# EAGLE design tinyPipes v2.6 (EAGLE 6.5.0)

## Sheet 1 of 3
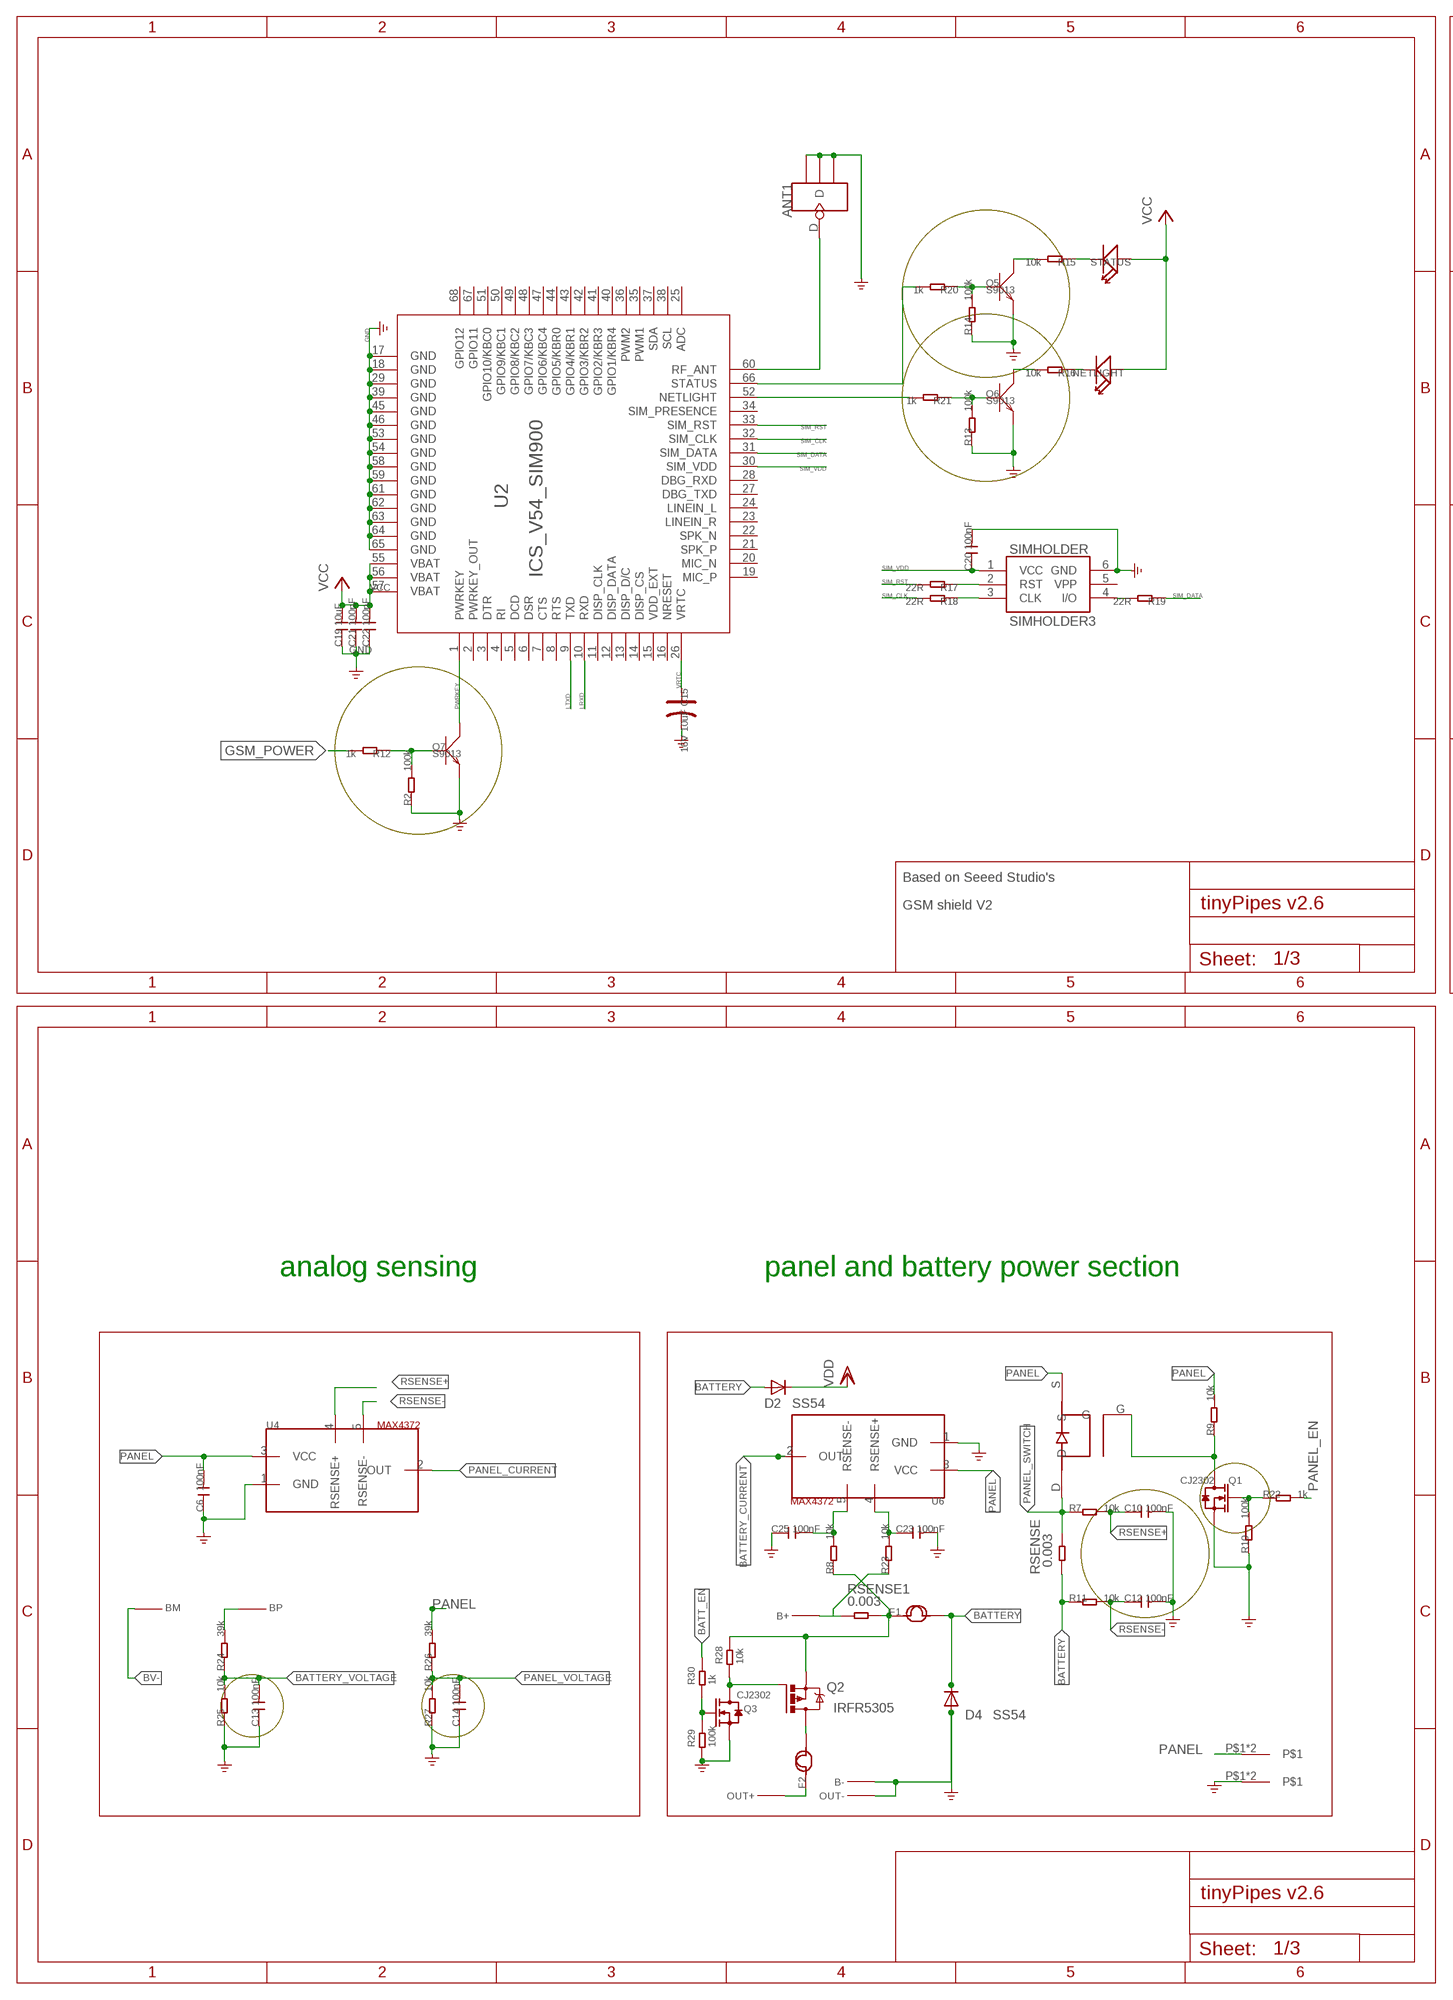
[diagram p0: schematic, sheet 1, part 1 of 2]
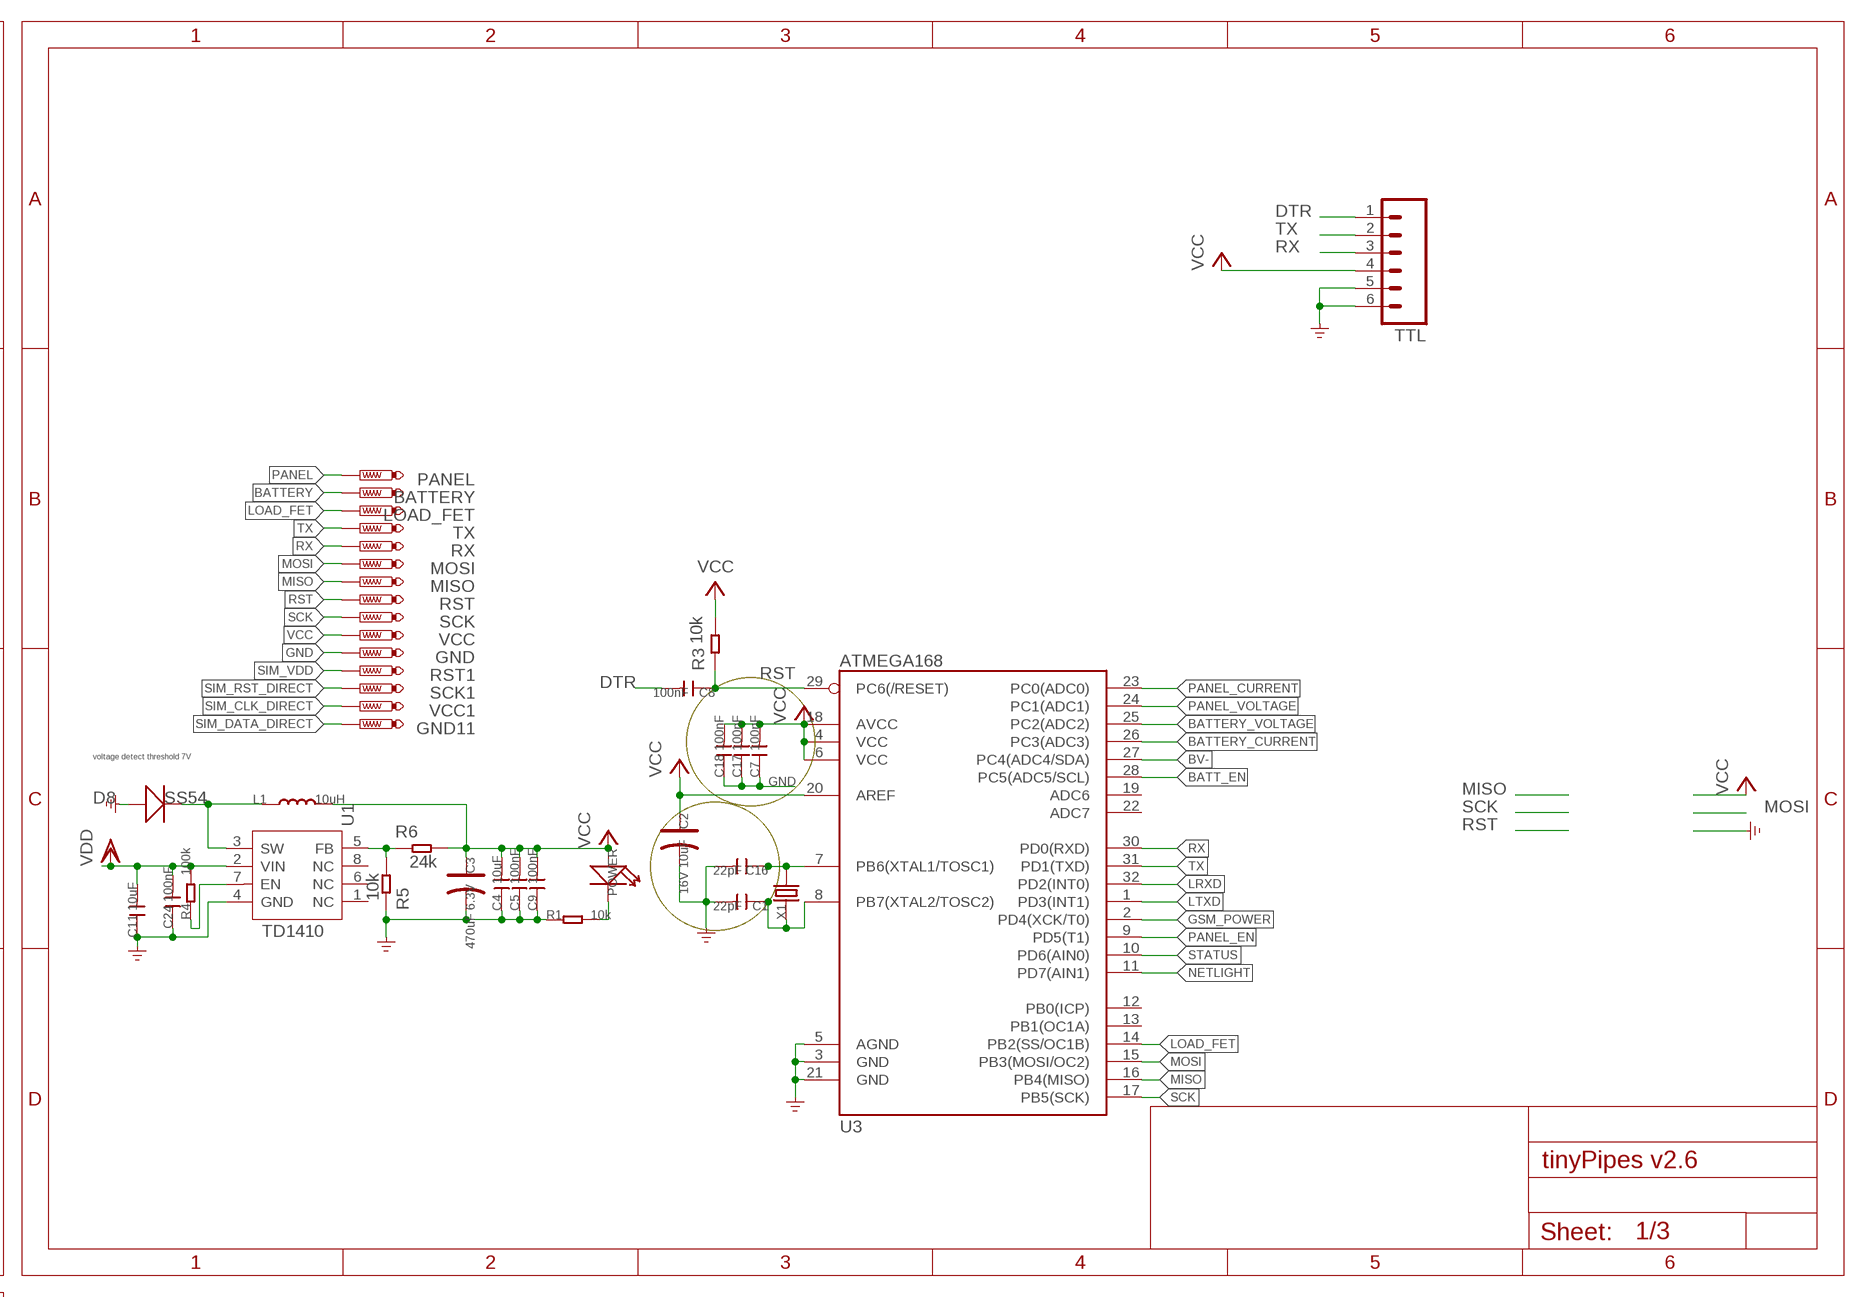
[diagram p1: schematic, sheet 1, part 2 of 2]

### Parts
ANT1  ANTENNA-U-FL  [4P-U-FL]
B+  TINYPIPES_BATTBATT  [TINYPIPES_BATT]
B-  TINYPIPES_BATTBATT  [TINYPIPES_BATT]
BATTERY  PTR1B2,54  [B2,54]
BM  TINYPIPES_BATTSBATT  [TINYPIPES_SBATT]
BP  TINYPIPES_BATTSBATT  [TINYPIPES_SBATT]
C1  22pF  C-0603  [C0603]
C2  16V 10uF  CAP-AVX-A  [AVX-A]
C3  470uF 6.3V  CAP-AVX-D  [AVX-D]
C4  10uF  C-0805  [C0805]
C5  100nF  C-0603  [C0603]
C6  100nF  C-0603  [C0603]
C7  100nF  C-0603  [C0603]
C8  100nF  C-0603  [C0603]
C9  100nF  C-0603  [C0603]
C10  100nF  C-0805  [C0805]
C11  10uF  C-0805  [C0805]
C12  100nF  C-0805  [C0805]
C13  100nF  C-0603  [C0603]
C14  100nF  C-0603  [C0603]
C15  16V 10uF  CAP-AVX-A  [AVX-A]
C16  22pF  C-0603  [C0603]
C17  100nF  C-0603  [C0603]
C18  100nF  C-0603  [C0603]
C19  10uF  C-0805  [C0805]
C20  100nF  C-0603  [C0603]
C21  100nF  C-0603  [C0603]
C22  100nF  C-0603  [C0603]
C23  100nF  C-0805  [C0805]
C24  100nF  C-0603  [C0603]
C25  100nF  C-0805  [C0805]
D2  SS54  DIODE-SMB  [SMB]
D4  SS54  DIODE-SMB  [SMB]
D8  SS54  D'MBRS240LT3'  [SMB]
F1  FUSE16R700  [0210]
F2  FUSE16R700  [0210]
GND  PTR1B2,54  [B2,54]
GND11  PTR1B2,54  [B2,54]
L1  10uH  L'0630'  [L0630]
LOAD_FET  PTR1B2,54  [B2,54]
MISO  PTR1B2,54  [B2,54]
MOSI  PTR1B2,54  [B2,54]
NETLIGHT  LED'0603'  [LED-0603]
OUT+  TINYPIPES_BATTBATT  [TINYPIPES_BATT]
OUT-  TINYPIPES_BATTBATT  [TINYPIPES_BATT]
PANEL  PTR1B2,54  [B2,54]
PANEL+  TINYPIPES_BATTPANEL  [TINYPIPES_PANEL]
PANEL-  TINYPIPES_BATTPANEL  [TINYPIPES_PANEL]
POWER  LED'0603'  [LED-0603]
Q1  CJ2302  MOSFET-N'SOT23'  [SOT23]
Q2  IRFR5305  [D-PAK_TO252AA]
Q3  CJ2302  MOSFET-N'SOT23'  [SOT23]
Q5  S9013  TRANSISTOR-NPN-SOT23  [SOT23]
Q6  S9013  TRANSISTOR-NPN-SOT23  [SOT23]
Q7  S9013  TRANSISTOR-NPN-SOT23  [SOT23]
R1  10k  R-0603  [R0603]
R2  100k  R-0603  [R0603]
R3  10k  R-0603  [R0603]
R4  100k  R-0603  [R0603]
R5  10k  R-0603  [R0603]
R6  24k  R-0603  [R0603]
R7  10k  R-0603  [R0603]
R8  10k  R-0603  [R0603]
R9  10k  R-0603  [R0603]
R10  100k  R-0603  [R0603]
R11  10k  R-0603  [R0603]
R12  1k  R-0603  [R0603]
R13  100k  R-0603  [R0603]
R14  100k  R-0603  [R0603]
R15  10k  R-0603  [R0603]
R16  10k  R-0603  [R0603]
R17  22R  R-0603  [R0603]
R18  22R  R-0603  [R0603]
R19  22R  R-0603  [R0603]
R20  1k  R-0603  [R0603]
R21  1k  R-0603  [R0603]
R22  1k  R-0603  [R0603]
R23  10k  R-0603  [R0603]
R24  39k  R-0603  [R0603]
R25  10k  R-0603  [R0603]
R26  39k  R-0603  [R0603]
R27  10k  R-0603  [R0603]
R28  10k  R-0603  [R0603]
R29  100k  R-0603  [R0603]
R30  1k  R-0603  [R0603]
RSENSE  0.003  R-2512  [R2512]
RSENSE1  0.003  R-2512  [R2512]
RST  PTR1B2,54  [B2,54]
RST1  PTR1B2,54  [B2,54]
RX  PTR1B2,54  [B2,54]
SCK  PTR1B2,54  [B2,54]
SCK1  PTR1B2,54  [B2,54]
SIMHOLDER  SIMHOLDER3  [SIMHOLDER3]
STATUS  LED'0603'  [LED-0603]
TTL  M06LOCK  [1X06_LOCK]
TX  PTR1B2,54  [B2,54]
U1  TD1410  [SOP8]
U2  ICS_V54_SIM900  [ICS_V54_SIM900]
U3  ATMEGA168  [TQFP32-08]
U4  MAX4372  [SOT23-5]
U5  SI4435POWER  [SO8_FET]
U6  MAX4372  [SOT23-5]
VCC  PTR1B2,54  [B2,54]
VCC1  PTR1B2,54  [B2,54]
X1  CRYSTAL'5032'  [2P-SMD-5X3.2]

### Nets
BATT [power]: B+.1 R23.1 RSENSE1.1
BATT_EN: R30.2 U3.28(PC5(ADC5/SCL))
BATTERY [power]: BATTERY.TP D2.A D4.C F1.2 R11.1 RSENSE.1
BATTERY_CURRENT: U3.26(PC3(ADC3)) U6.2(OUT)
BATTERY_VOLTAGE: C13.2 R24.1 R25.2 U3.25(PC2(ADC2))
BV+: BP.P$1 R24.2
BV-: BM.P$1 U3.27(PC4(ADC4/SDA))
DTR: C8.2 TTL.1
GND: ANT1.GND1 ANT1.GND2 ANT1.GND3 B-.1 C1.2 C2.- C3.- C4.1 C5.1 C6.1 C7.1 C9.1 C10.2 C11.1 C12.2 C13.1 C14.1 C15.- C16.2 C17.1 C18.1 C19.1 C20.2 C21.1 C22.1 C23.2 C24.1 C25.1 D4.A D8.+ GND.TP OUT-.1 PANEL-.P$1 PANEL-.P$2 Q1.2(S) Q3.2(S) Q5.2(E) Q6.2(E) Q7.2(E) R1.1 R2.1 R5.2 R10.1 R13.1 R14.1 R25.1 R27.1 R29.1 SIMHOLDER.6(GND) TTL.5 TTL.6 U1.4(GND) U2.17(GND) U2.18(GND) U2.29(GND) U2.39(GND) U2.45(GND) U2.46(GND) U2.53(GND) U2.54(GND) U2.58(GND) U2.59(GND) U2.61(GND) U2.62(GND) U2.63(GND) U2.64(GND) U2.65(GND) U3.3(GND) U3.5(AGND) U3.21(GND) U4.1(GND) U6.1(GND)
GSM_POWER: R12.2 U3.2(PD4(XCK/T0))
LOAD_FET: LOAD_FET.TP U3.14(PB2(SS/OC1B))
LRXD: U2.10(RXD) U3.32(PD2(INT0))
LTXD: U2.9(TXD) U3.1(PD3(INT1))
MISO: MISO.TP U3.16(PB4(MISO))
MOSI: MOSI.TP U3.15(PB3(MOSI/OC2))
N$1: ANT1.D U2.60(RF_ANT)
N$2: C16.1 U3.7(PB6(XTAL1/TOSC1)) X1.2
N$3: Q6.3(C) R16.2
N$4: Q7.1(B) R2.2 R12.1
N$5: Q5.1(B) R14.2 R20.1
N$6: Q6.1(B) R13.2 R21.1
N$7: NETLIGHT.- R16.1
N$8: Q5.3(C) R15.2
N$9: POWER.- R1.2
N$10 [power]: F1.1 Q2.3(S) R8.1 R28.2 RSENSE1.2
N$11: Q1.1(G) R10.2 R22.1
N$12: R4.1 U1.7(EN)
N$13: C1.1 U3.8(PB7(XTAL2/TOSC2)) X1.1
N$14: C25.2 R8.2 U6.5(RSENSE-)
N$15: Q1.3(D) R9.1 U5.G
N$16: R15.1 STATUS.-
N$17: C23.1 R23.2 U6.4(RSENSE+)
N$18: F2.2 Q2.4(D)
N$19: F2.1 OUT+.1
N$20: Q2.1(G) Q3.3(D) R28.1
N$21: Q3.1(G) R29.2 R30.1
N$38: D8.- L1.1 U1.3(SW)
N$47: R5.1 R6.1 U1.5(FB)
NETLIGHT: R21.2 U2.52(NETLIGHT) U3.11(PD7(AIN1))
PANEL [power]: C6.2 PANEL+.P$1 PANEL+.P$2 PANEL.TP R9.2 R26.2 U4.3(VCC) U5.S U6.3(VCC)
PANEL_CURRENT: U3.23(PC0(ADC0)) U4.2(OUT)
PANEL_EN: R22.2 U3.9(PD5(T1))
PANEL_SWITCH [power]: R7.1 RSENSE.2 U5.D
PANEL_VOLTAGE: C14.2 R26.1 R27.2 U3.24(PC1(ADC1))
PWRKEY: Q7.3(C) U2.1(PWRKEY)
RSENSE+ [power]: C10.1 R7.2 U4.4(RSENSE+)
RSENSE- [power]: C12.1 R11.2 U4.5(RSENSE-)
RST: C8.1 R3.1 RST.TP U3.29(PC6(/RESET))
RX: RX.TP TTL.3 U3.30(PD0(RXD))
SCK: SCK.TP U3.17(PB5(SCK))
SIM_CLK: R18.2 U2.32(SIM_CLK)
SIM_CLK_DIRECT: R18.1 SIMHOLDER.3(CLK) VCC1.TP
SIM_DATA: R19.1 U2.31(SIM_DATA)
SIM_DATA_DIRECT: GND11.TP R19.2 SIMHOLDER.4(I/O)
SIM_RST: R17.2 U2.33(SIM_RST)
SIM_RST_DIRECT: R17.1 SCK1.TP SIMHOLDER.2(RST)
SIM_VDD: C20.1 RST1.TP SIMHOLDER.1(VCC) U2.30(SIM_VDD)
STATUS: R20.2 U2.66(STATUS) U3.10(PD6(AIN0))
TX: TTL.2 TX.TP U3.31(PD1(TXD))
VCC: C2.+ C3.+ C4.2 C5.2 C7.2 C9.2 C17.2 C18.2 C19.2 C21.2 C22.2 L1.2 NETLIGHT.+ POWER.+ R3.2 R6.2 STATUS.+ TTL.4 U2.55(VBAT) U2.56(VBAT) U2.57(VBAT) U3.4(VCC) U3.6(VCC) U3.18(AVCC) U3.20(AREF) VCC.TP
VDD: C11.2 C24.2 D2.C R4.2 U1.2(VIN)
VRTC: C15.+ U2.26(VRTC)
Unconnected: SIMHOLDER.5(VPP) U1.1(NC) U1.6(NC) U1.8(NC) U2.2(PWRKEY_OUT) U2.3(DTR) U2.4(RI) U2.5(DCD) U2.6(DSR) U2.7(CTS) U2.8(RTS) U2.11(DISP_CLK) U2.12(DISP_DATA) U2.13(DISP_D/C) U2.14(DISP_CS) U2.15(VDD_EXT) U2.16(NRESET) U2.19(MIC_P) U2.20(MIC_N) U2.21(SPK_P) U2.22(SPK_N) U2.23(LINEIN_R) U2.24(LINEIN_L) U2.25(ADC) U2.27(DBG_TXD) U2.28(DBG_RXD) U2.34(SIM_PRESENCE) U2.35(PWM1) U2.36(PWM2) U2.37(SDA) U2.38(SCL) U2.40(GPIO1/KBR4) U2.41(GPIO2/KBR3) U2.42(GPIO3/KBR2) U2.43(GPIO4/KBR1) U2.44(GPIO5/KBR0) U2.47(GPIO6/KBC4) U2.48(GPIO7/KBC3) U2.49(GPIO8/KBC2) U2.50(GPIO9/KBC1) U2.51(GPIO10/KBC0) U2.67(GPIO11) U2.68(GPIO12) U3.12(PB0(ICP)) U3.13(PB1(OC1A)) U3.19(ADC6) U3.22(ADC7)

### Notes on the sheet
- voltage detect threshold 7V
- Based on Seeed Studio's
- GSM shield V2
- analog sensing | panel and battery power section

## Sheet 2 of 3

## Sheet 3 of 3

## Library data of the parts
ANT1 = Connector:ANTENNA-U-FL
B+ B- BM BP OUT+ OUT- = tinyPipes v2.6:TINYPIPES_BATT
BATTERY GND GND11 LOAD_FET MISO MOSI PANEL RST RST1 RX SCK SCK1 TX VCC VCC1 = testpad:PTR1: TEST PIN
C1 C4-C14 C16-C25 = Discrete:C*: Ceramic Capacitors
C2 C3 C15 = Discrete:CAP*: Electrolytic Capacitors,Tantalum Capacitors and Super Capacitors
D2 D4 = diode:DIODE-: DIODE
D8 = Discrete:D*
F1 F2 = tinyPipes v2.6:FUSE
L1 = Discrete:L*
NETLIGHT POWER STATUS = Discrete:LED*
PANEL+ PANEL- = tinyPipes_v2.5:TINYPIPES_BATT
Q1 Q3 = Discrete:MOSFET-N: IRLL014: http://www.vishay.com/docs/91319/sihll014.pdf
Q2 = transistor-power:IRF?5305: HEXFET Power MOSFET Source: http://www.irf.com/product-info/datasheets/data/irfr5305pbf.pdf
Q5-Q7 = Discrete:TRANSISTOR-NPN*: NPN audion
R1-R30 RSENSE RSENSE1 = Discrete:R*
SIMHOLDER = SparkFun2:SIMHOLDER3
TTL = SparkFun-Connectors:M06: Header 6 Standard 6-pin 0.1" header. Use with straight break away headers (SKU : PRT-00116), right angle break away headers (PRT-00553), swiss pins (PRT-00743), machine pins (PRT-00117), and female headers (PRT-00115). Molex polarized connector foot print use with SKU : PRT-08094 with associated crimp pins and housings. NOTES ON THE VARIANTS LOCK and LOCK_LONGPADS... This footprint was designed to help hold the alignment of a through-hole component (i.e. 6-pin header) while soldering it into place. You may notice that each hole has been shifted either up or down by 0.005 of an inch from it's more standard position (which is a perfectly straight line). This slight alteration caused the pins (the squares in the middle) to touch the edges of the holes. Because they are alternating, it causes a "brace" to hold the component in place. 0.005 has proven to be the perfect amount of "off-center" position when using our standard breakaway headers. Although looks a little odd when you look at the bare footprint, once you have a header in there, the alteration is very hard to notice. Also,if you push a header all the way into place, it is covered up entirely on the bottom side. This idea of altering the position of holes to aid alignment will be further integrated into the Sparkfun Library for other footprints. It can help hold any component with 3 or more connection pins.
U1 = template:TD1410: 2A 380KHz 20V PWM Buck DC/DC Converter
U2 = tinyPipes v2.2:ICS_V54_SIM900
U3 = SparkFun:ATMEGA168
U4 U6 = tinyPipes:MAX4372
U5 = tinyPipes:SI4435
X1 = Discrete:CRYSTAL*: CRYSTAL

## Board
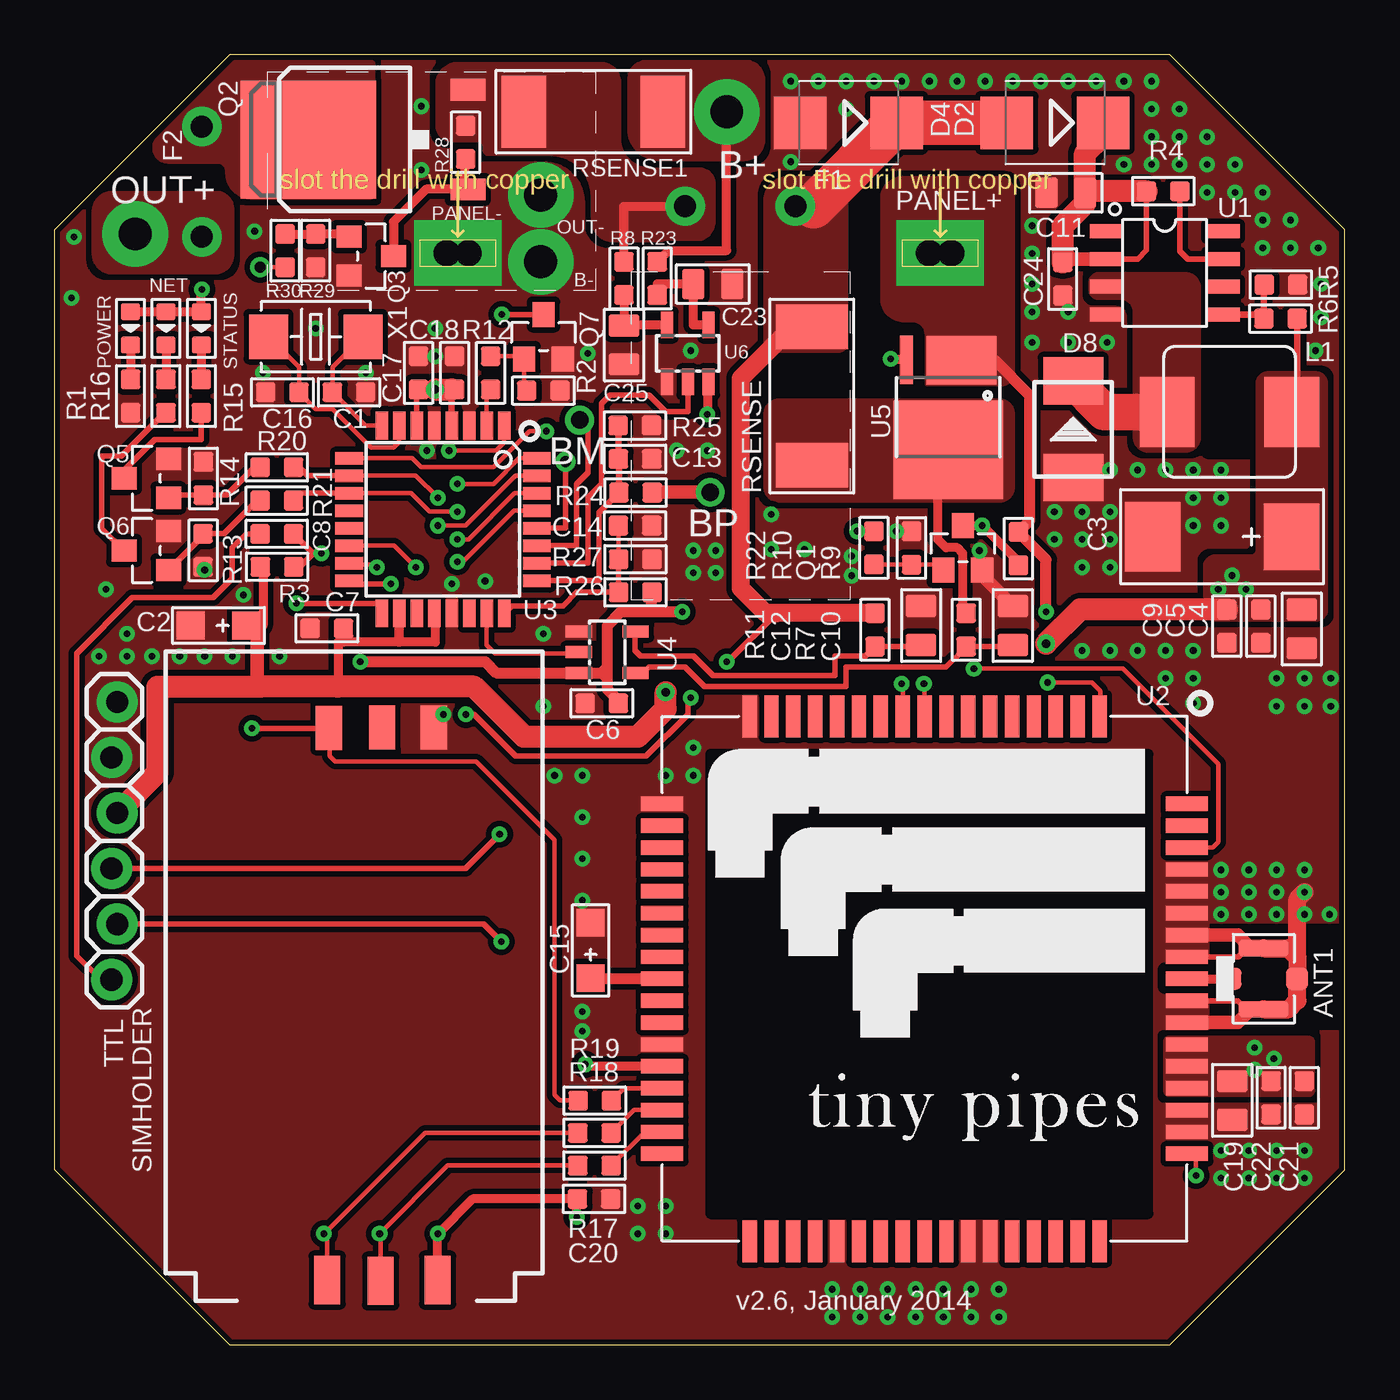
[diagram p2: board, top side]
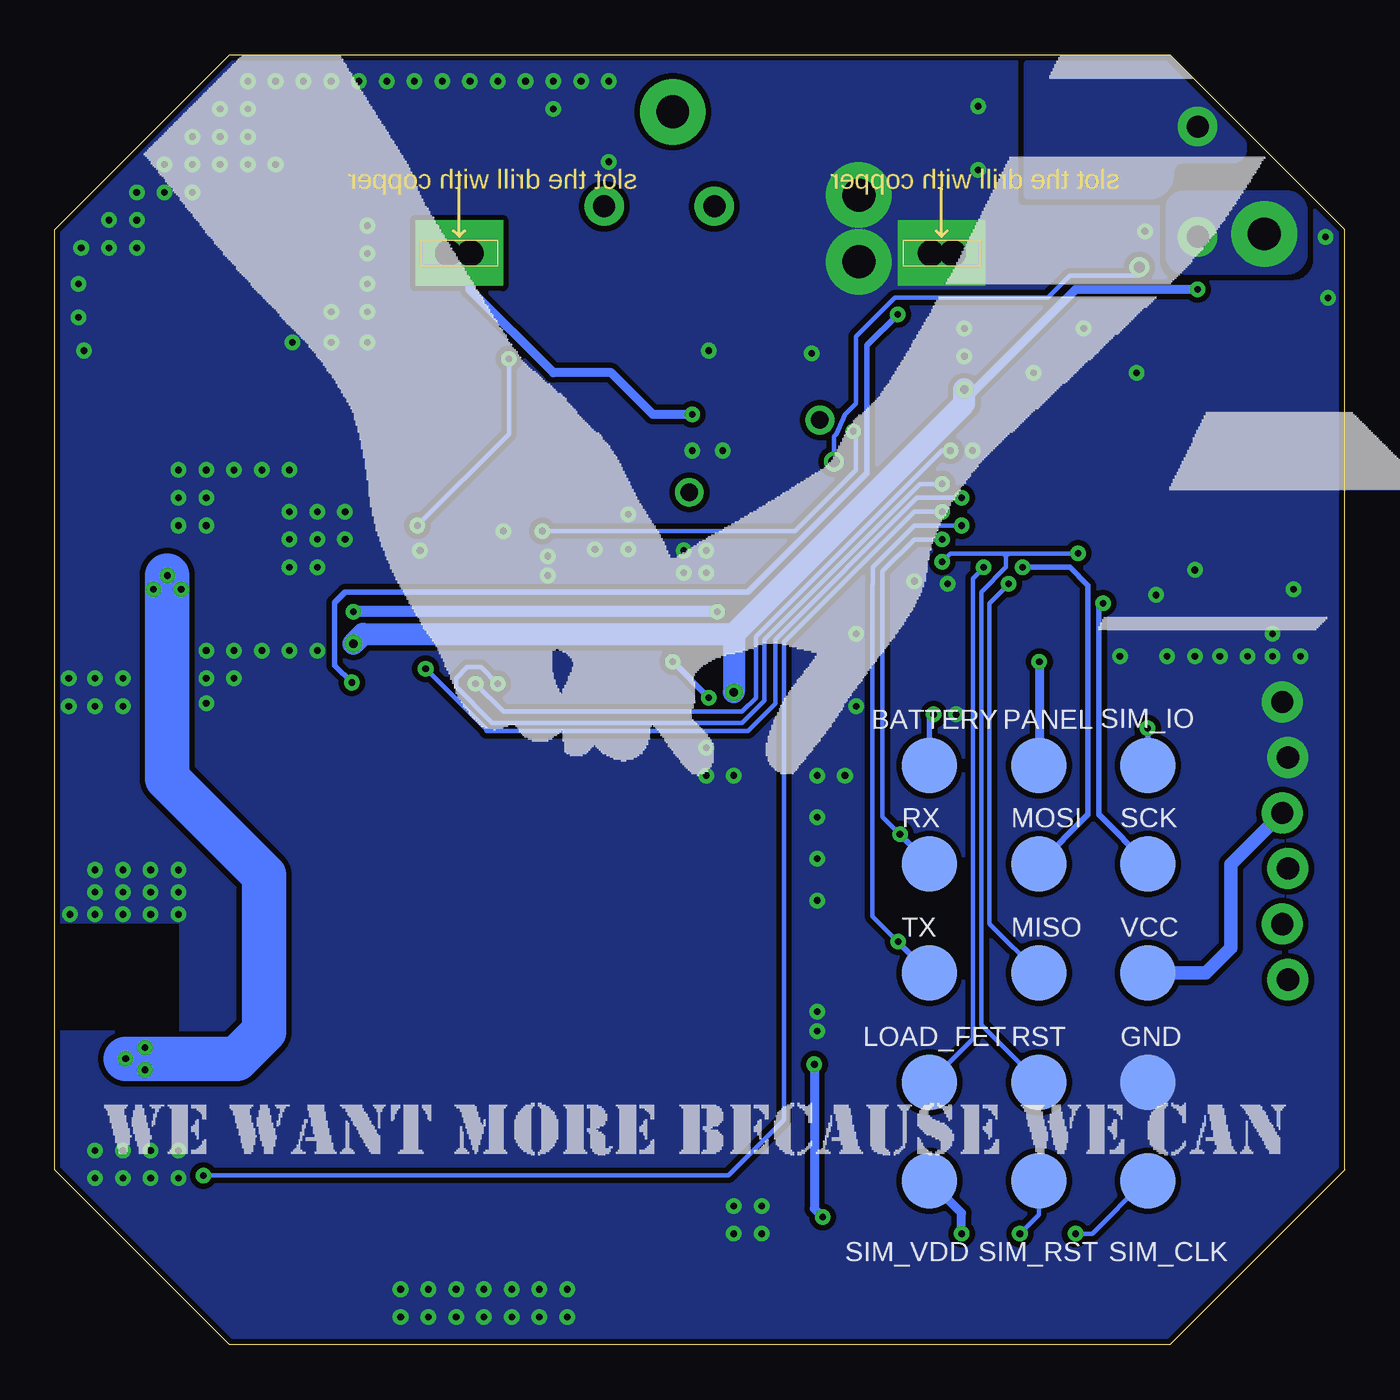
[diagram p3: board, bottom side, seen from below]

Size 59 x 59 mm. Coordinates in mm from the lower left corner, seen from the top.
Outline: 8,0 51,0 59,8 59,51 51,59 8,59 0,51 0,8 8,0
Copper layers (1*16): Top 0.035mm / dielectric 1.5mm / Bottom 0.035mm
Design rules "default *": minimum track width 6mil, minimum drill 12mil, track to track 6mil, track to pad 6mil, pad to pad 6mil, via to via 6mil, smd to smd 0mil, copper to edge 10mil, drill to drill 8mil, minimum pad ring 10mil, minimum via ring 8mil, stop-mask expansion 4mil, vias tented up to drill 0.7mm, thermal gap 10mil
tRestrict: area 30,6 to 50,27; area 52.7,40.8 to 54.6,44.6; 8 lines

### Footprints (pad centres in the part's own frame; a part is rotated, then mirrored left to right if it is on the bottom)
4P-U-FL = smd 1.016 x 1.016: D -1.524,0; GND3 1.524,0 | smd 2.286 x 0.762: GND1 0,1.397; GND2 0,-1.397
TINYPIPES_BATT = drill 1.5 pad 3: 1 0,0
B2,54 = smd 2.54 x 2.54: TP 0,0
TINYPIPES_SBATT = drill 0.8: P$1 0,0
C0603 = smd 0.889 x 0.889: 1 -0.762,0; 2 0.762,0
AVX-A = smd 1.27 x 1.27: + -1.27,0; - 1.27,0
AVX-D = smd 2.54 x 3.048: + -3.175,0 | smd 2.54 x 3.175: - 3.175,0
C0805 = smd 1.016 x 1.397: 1 -0.889,0; 2 0.889,0
SMB = smd 2.4 x 2.4: A 2.2,0; C -2.2,0
SMB' = smd 2.159 x 2.743: + -2.21,0; - 2.21,0
0210 = drill 1 pad 1.8: 1 -2.54,0; 2 2.5,0
L0630 = smd 2.5 x 3.2: 1 -2.85,0; 2 2.85,0
LED-0603 = smd 0.762 x 0.889: + -0.762,0; - 0.762,0
TINYPIPES_PANEL = drill 1.2 pad 3 square: P$1 -0.492,0; P$2 0.508,0
SOT23 = smd 1.016 x 1.143: 1 -0.889,-1.016; 2 0.889,-1.016; 3 0,1.016
D-PAK_TO252AA = smd 1 x 1.6: 1 -2.28,-4.8; 3 2.28,-4.8 | smd 5.4 x 6.2: 4 0,2.5
R0603 = smd 0.889 x 0.889: 1 -0.762,0; 2 0.762,0
R2512 = smd 2.032 x 3.302: 1 -3.175,0; 2 3.175,0
SIMHOLDER3 = smd 2.2 x 1.2: 1 0.95,4.81; 2 0.91,7.41; 3 0.95,9.86 | smd 2 x 1.2: 4 26.2,9.78; 5 26.22,7.34; 6 26.22,4.98
1X06_LOCK = drill 1.016 pad 1.88: 1 0,0; 2 2.54,-0.254; 3 5.08,0; 4 7.62,-0.254; 5 10.16,0; 6 12.7,-0.254
SOP8 = smd 0.635 x 1.524: 1 -1.905,-2.667; 2 -0.635,-2.667; 3 0.635,-2.667; 4 1.905,-2.667; 5 1.905,2.667; 6 0.635,2.667; 7 -0.635,2.667; 8 -1.905,2.667
ICS_V54_SIM900 = smd 1.93 x 0.66: 1 -12,8; 2 -12,7; 3 -12,6; 4 -12,5; 5 -12,4; 6 -12,3; 7 -12,2; 8 -12,1; 9 -12,0; 10 -12,-1; 11 -12,-2; 12 -12,-3; 13 -12,-4; 14 -12,-5; 15 -12,-6; 16 -12,-7; 17 -12,-8; 35 12,-8; 36 12,-7; 37 12,-6; 38 12,-5; 39 12,-4; 40 12,-3; 41 12,-2; 42 12,-1; 43 12,0; 44 12,1; 45 12,2; 46 12,3; 47 12,4; 48 12,5; 49 12,6; 50 12,7; 51 12,8 | smd 0.66 x 1.93: 18 -8,-12; 19 -7,-12; 20 -6,-12; 21 -5,-12; 22 -4,-12; 23 -3,-12; 24 -2,-12; 25 -1,-12; 26 0,-12; 27 1,-12; 28 2,-12; 29 3,-12; 30 4,-12; 31 5,-12; 32 6,-12; 33 7,-12; 34 8,-12; 52 8,12; 53 7,12; 54 6,12; 55 5,12; 56 4,12; 57 3,12; 58 2,12; 59 1,12; 60 0,12; 61 -1,12; 62 -2,12; 63 -3,12; 64 -4,12; 65 -5,12; 66 -6,12; 67 -7,12; 68 -8,12
TQFP32-08 = smd 1.27 x 0.559: 1 -4.293,2.8; 2 -4.293,2; 3 -4.293,1.2; 4 -4.293,0.4; 5 -4.293,-0.4; 6 -4.293,-1.2; 7 -4.293,-2; 8 -4.293,-2.8; 17 4.293,-2.8; 18 4.293,-2; 19 4.293,-1.2; 20 4.293,-0.4; 21 4.293,0.4; 22 4.293,1.2; 23 4.293,2; 24 4.293,2.8 | smd 0.559 x 1.27: 9 -2.8,-4.293; 10 -2,-4.293; 11 -1.2,-4.293; 12 -0.4,-4.293; 13 0.4,-4.293; 14 1.2,-4.293; 15 2,-4.293; 16 2.8,-4.293; 25 2.8,4.293; 26 2,4.293; 27 1.2,4.293; 28 0.4,4.293; 29 -0.4,4.293; 30 -1.2,4.293; 31 -2,4.293; 32 -2.8,4.293
SOT23-5 = smd 0.55 x 1.2: 1 -0.95,-1.3; 2 0,-1.3; 3 0.95,-1.3; 4 0.95,1.3; 5 -0.95,1.3
SO8_FET = smd 5 x 4.5: D 0,1.5 | smd 0.61 x 2.21: G 1.905,-2.616 | smd 3.2 x 2.2: S -0.6,-2.6
2P-SMD-5X3.2 = smd 1.778 x 2.032: 1 -2.159,0; 2 2.159,0

### Placement (x,y rotation side)
ANT1  55.29,16.74 0 top
B+  30.73,56.39 0 top
B-  22.23,49.53 0 top
BATTERY  19,26.5 0 bottom
BM  24,42.29 0 top
BP  29.97,38.99 0 top
C1  13.46,43.56 0 top
C2  7.49,32.89 180 top
C3  53.39,36.95 180 top
C4  57.03,32.74 90 top
C5  55.16,32.86 90 top
C6  25.02,29.34 0 top
C7  12.45,32.77 0 top
C8  10.16,37.08 180 top
C9  53.6,32.86 90 top
C10  43.81,32.89 90 top
C11  46.24,52.68 0 top
C12  39.62,32.89 90 top
C13  26.54,40.51 180 top
C14  26.54,37.47 180 top
C15  24.51,18.03 90 top
C16  10.41,43.56 180 top
C17  16.64,44.45 270 top
C18  18.29,44.45 270 top
C19  53.85,11.18 90 top
C20  24.67,6.67 0 top
C21  57.15,11.3 90 top
C22  55.63,11.3 90 top
C23  30.1,48.51 0 top
C24  46.1,48.74 90 top
C25  26.04,45.72 90 top
D2  45.74,55.89 180 top
D4  36.3,55.88 180 top
D8  SS54  [SMB']  46.58,41.88 90 top
F1  31.37,52.07 0 top
F2  6.73,53.21 90 top
GND  9,12 0 bottom
GND11  9,26.5 0 bottom
L1  53.73,42.67 0 top
LOAD_FET  19,12 0 bottom
MISO  14,17 0 bottom
MOSI  14,22 0 bottom
NETLIGHT  5.09,46.48 270 top
OUT+  3.68,50.8 0 top
OUT-  22.23,52.58 0 top
PANEL  14,26.5 0 bottom
PANEL+  40.5,49.93 180 top
PANEL-  18.44,49.93 180 top
POWER  3.47,46.48 270 top
Q1  41.53,36.45 0 top
Q2  14.1,55.12 90 top
Q3  14.48,49.78 270 top
Q5  4.19,39.62 90 top
Q6  4.19,36.32 90 top
Q7  22.35,46.1 0 top
R1  3.47,43.39 90 top
R2  22.35,43.64 180 top
R3  10.17,35.58 180 top
R4  50.69,52.76 180 top
R5  56.08,48.48 0 top
R6  56.06,46.93 0 top
R7  41.68,32.7 270 top
R8  26.04,48.77 270 top
R9  44.07,36.41 90 top
R10  39.19,36.44 270 top
R11  37.52,32.7 270 top
R12  19.94,44.45 270 top
R13  6.79,36.34 90 top
R14  6.8,39.62 270 top
R15  6.71,43.39 270 top
R16  5.09,43.39 270 top
R17  24.68,8.2 0 top
R18  24.68,9.69 0 top
R19  24.7,11.17 180 top
R20  10.16,40.13 0 top
R21  10.16,38.61 0 top
R22  37.47,36.45 90 top
R23  27.56,48.77 270 top
R24  26.57,38.97 0 top
R25  26.53,42.04 180 top
R26  26.56,34.41 0 top
R27  26.56,35.92 180 top
R28  18.8,54.99 90 top
R29  11.94,50.04 90 top
R30  10.54,50.04 270 top
RSENSE  34.63,43.39 270 top
RSENSE1  24.64,56.39 180 top
RST  14,12 0 bottom
RST1  19,7.5 0 bottom
RX  19,22 0 bottom
SCK  9,22 0 bottom
SCK1  14,7.5 0 bottom
SIMHOLDER  22.32,2.01 90 top
STATUS  6.71,46.48 270 top
TTL  2.6,16.7 90 top
TX  19,17 0 bottom
U1  50.76,49.02 270 top
U2  39.78,16.74 270 top
U3  17.76,37.74 270 top
U4  25.27,31.67 270 top
U5  40.86,42.42 180 top
U6  28.96,45.34 0 top
VCC  9,17 0 bottom
VCC1  9,7.5 0 bottom
X1  11.94,46.1 180 top

### Tracks (layer width: path | path; a pad name or v marks a point on that pad's centre or on a via)
BATT
  Top 0.406: R23.1 28.07,50.04 30.73,50.04 B+.1
  pour Top (isolate 0.254, no thermals): 26.29,55.58 26.29,57.86 arc-90 27.1,58.67 31.57,58.67 arc-90 32.38,57.86 32.38,55.08 arc-90 31.53,54.23 27.64,54.23 arc-90
BATT_EN  (via drill 0.5)
  Top 0.203: v9.4,49.28 R30.2
  Top 0.254: U3.28 23.37,37.34 v23.37,40.39
  Bottom 0.203: v23.37,40.39 23.37,41.53 23.24,41.66 22.86,42.55 22.35,43.05 22.35,46.1 20.57,47.88 13.59,47.88 12.57,48.9 9.4,48.9 v9.4,49.28
BATTERY  (via drill 0.3)
  Top 0.254: v18.8,28.83 19.18,28.83 21.08,26.92 27.05,26.92 28.96,28.83 28.96,29.46 v29.08,29.59 | v30.73,31.24 30.8,31.24 33.02,33.46
  Top 0.813: R11.1 33.02,33.46 32.51,33.46 31.37,34.6 31.37,44.2 33.48,46.31
  Top 2.032: 43.49,55.94 D2.A D4.C 34.69,52.07
  Bottom 0.254: BATTERY.TP 19,28.83 v18.8,28.83 | v29.08,29.59 v30.73,31.24
  pour Top (isolate 0.254, no thermals): 35.84,45.47 32.51,45.47 32.51,52.35 arc-90 33.5,53.34 36.2,53.34 36.2,45.83 arc-90
BATTERY_CURRENT
  Top 0.254: U6.2 28.96,42.67 27.94,42.67 27.18,43.43 25.4,43.43 25.02,43.05 25.02,39.37 24.38,38.73 24.38,35.74 U3.26
BATTERY_VOLTAGE
  Top 0.254: U3.25 24.89,34.94 24.89,38.06 R24.1
  Top 0.305: R24.1 25.8,40.49 C13.2 R25.2
BV+
  Top 0.61: BP.P$1 27.34,38.99 R24.2
BV-
  Top 0.254: U3.27 23.88,36.54 23.88,39.37 24.38,39.88 24.38,41.91 BM.P$1
DTR
  Top 0.254: TTL.1 2.1,16.7 1.02,17.78 1.02,31.62 3.56,34.16 7.24,34.16 8.13,35.05 8.13,36.45 8.76,37.08 C8.2
GND  (via drill 0.3 pad 0.64)
  Top 0.254: U2.59 54.11,15.74 54.61,15.24 | U2.61 54.13,17.74 54.52,18.14
  Top 0.406: 54.61,15.24 55.19,15.24 ANT1.GND2
  Top 0.61: Q1.2 42.42,35.18 C10.2 | U2.58 54.11,14.74 54.61,15.24 | U2.62 54.09,18.74 54.55,18.29 54.55,18.16 54.52,18.14 ANT1.GND1
  Top 0.813: ANT1.GND1 56.42,18.14 56.83,17.72 | 56.83,17.72 56.83,16.72 | ANT1.GND2 56.43,15.34 56.83,15.75 56.83,16.72 | 56.83,16.72 ANT1.GND3 | 56.83,17.72 56.83,20.38 v57.15,20.7
  other vias: 22.35,32.51 22.35,29.21 17.4,45.21 17.02,40.89 33.66,57.78 34.92,57.78 36.2,57.78 36.2,56.52 33.66,54.1 37.47,57.78 38.73,57.78 40.01,57.78 41.27,57.78 42.55,57.78 43.81,57.78 45.09,57.78 46.35,57.78 47.62,57.78 48.9,57.78 50.16,57.78 51.44,56.52 50.16,56.52 50.16,55.24 51.44,55.24 52.7,55.24 50.16,53.98 51.44,53.98 48.9,53.98 52.7,53.98 52.7,52.7 53.98,52.7 53.98,53.98 55.24,52.7 55.24,51.44 55.24,50.16 56.52,50.16 56.52,51.44 44.7,51.18 44.7,49.91 44.7,48.51 44.7,47.24 44.7,45.85 46.35,45.85 46.35,47.24 48.13,45.85 45.72,38.1 46.99,38.1 48.26,38.1 48.26,36.83 46.99,36.83 45.72,36.83 46.99,35.56 48.26,35.56 52.07,31.75 55.88,30.48 57.15,30.48 57.15,29.21 55.88,29.21 52.07,29.34 52.07,30.48 48.26,40.01 49.53,40.01 52.07,38.73 53.34,38.73 52.07,40.01 53.34,40.01 50.8,40.01 52.07,37.47 53.34,37.47 57.91,48.51 57.78,50.16 57.91,46.99 57.66,45.47 24.13,20.32 53.34,19.68 54.61,19.68 55.88,19.68 57.15,19.68 58.29,19.68 9.53,44.45 14.22,44.45 11.94,46.48 3.3,31.5 2.03,31.5 19.68,34.92 53.34,8.89 54.61,8.89 55.88,8.89 57.15,8.89 57.15,7.62 55.88,7.62 54.61,7.62 53.34,7.62 8.64,34.29 53.34,21.72 53.34,20.7 54.61,20.7 54.61,21.72 55.88,21.72 55.88,20.7 57.15,21.72 35.56,2.54 36.83,2.54 38.1,2.54 39.37,2.54 40.64,2.54 41.91,2.54 43.18,2.54 27.94,26.04 29.21,26.04 29.21,27.3 24.13,15.24 38.48,37.21 36.45,36.07 36.45,35.18 34.29,36.39 32.77,37.97 18.16,34.8 22.86,26.04 24.13,26.04 24.13,24.13 24.13,22.23 17.78,28.83 2.35,34.54 8.13,31.5 35.56,1.27 36.83,1.27 38.1,1.27 39.37,1.27 40.64,1.27 41.91,1.27 43.18,1.27 42.29,36.32 46.99,31.75 48.26,31.75 50.8,31.75 50.8,30.48 49.53,31.75 58.36,30.48 58.36,29.21 32.77,36.39 28.45,40.89 29.84,40.89 30.23,36.32 24.13,14.35 26.67,6.35 27.94,6.35 26.67,5.08 27.94,5.08 17.4,46.48 29.21,36.32 30.23,35.31 29.21,35.31 6.86,35.43 10.29,31.5 29.08,45.47 6.86,31.5 5.71,31.5 4.45,31.5 3.3,32.51 0.76,47.88 0.89,50.67 16.76,56.64 16.76,53.72 24.38,45.34 9.14,50.93
  pour Top (isolate 0.254, rank 6, no thermals): 0,59.05 59.05,59.05 59.05,19.37 52.7,19.37 52.7,14.29 59.05,14.29 59.05,0 0,0
  pour Bottom (isolate 0.254, rank 6, no thermals): 0,59.05 59.05,59.05 59.05,19.37 53.21,19.37 53.21,14.29 59.05,14.29 59.05,0 0,0
GSM_POWER
  Top 0.203: U3.2 19.76,43.51 R12.2
LOAD_FET  (via drill 0.3 pad 0.64)
  Top 0.203: U3.14 15.53,36.54 v16.51,35.56
  Bottom 0.203: v16.51,35.56 17.02,35.05 17.02,13.98 LOAD_FET.TP
LRXD  (via drill 0.3 pad 0.64)
  Top 0.203: U3.32 21.24,40.54 20.07,39.37 v18.41,39.37 | U2.10 38.78,30.18 v38.73,30.23
  Bottom 0.203: v38.73,30.23 39.5,30.99 40.13,30.99 40.64,30.48 40.64,30.1 38.99,28.45 27.56,28.45 26.54,29.46 26.54,32.26 19.43,39.37 v18.41,39.37
LTXD  (via drill 0.3 pad 0.64)
  Top 0.203: 20.7,42.29 20.56,42.15 U3.1 20.56,41.26 20.19,40.89 v18.03,40.89 | U2.9 39.78,30.2 v39.75,30.23
  Bottom 0.203: v39.75,30.23 38.48,28.96 27.56,28.96 26.92,29.59 26.92,32.38 18.41,40.89 v18.03,40.89
MISO  (via drill 0.3 pad 0.64)
  Top 0.254: U3.16 13.82,34.94 13.97,34.8 v15.37,34.8
  Bottom 0.203: v15.37,34.8 16.26,33.91 16.26,19.26 MISO.TP
  Bottom 0.254: MISO.TP 14,17.18
MOSI  (via drill 0.3 pad 0.64)
  Top 0.203: 13.52,35.69 14.61,35.69 v14.73,35.56
  Top 0.254: 13.52,35.69 U3.15
  Bottom 0.254: 13.94,22 MOSI.TP 11.74,24.26 11.74,34.73 12.57,35.56 v14.73,35.56
N$1
  Top 0.406: U2.60 ANT1.D
N$2
  Top 0.203: U3.7 15.76,41.28 15.49,41.02 14.48,41.02 12.7,42.8 11.94,42.8 C16.1 11.18,44.7 X1.2
N$3
  Top 0.254: R16.2 5.03,42.63 3.05,40.64 2.16,40.64 2.16,37.34 Q6.3
N$4
  Top 0.203: R12.1 21.46,45.21 Q7.1 21.46,43.76 R2.2
N$5
  Top 0.254: Q5.1 5.33,38.86 R14.2 7.87,38.86 9.14,40.13 R20.1
N$6
  Top 0.254: Q6.1 6.79,37.01 R13.2 7.76,37.1 9.27,38.61 R21.1
N$7
  Top 0.406: NETLIGHT.- R16.1
N$8
  Top 0.254: Q5.3 3.17,40.01 4.57,41.4 6.71,41.4 R15.2
N$9
  Top 0.406: POWER.- R1.2
N$10
  Top 0.406: R8.1 26.04,52.07 F1.1
  pour Top (isolate 0.254, no thermals): 19.68,54.66 19.68,54.83 arc90 19.4,55.12 18.21,55.12 arc-90 17.53,55.8 17.53,57.63 arc-90 18.44,58.55 24.97,58.55 arc-90 25.78,57.73 25.78,55.16 arc90 27.22,53.72 29.46,53.72 arc-90 30.1,53.09 30.1,51.4 arc-90 29.25,50.55 25.54,50.55 arc-90 24.64,51.44 24.64,52.5 arc90 22.65,54.48 19.86,54.48 arc-90
N$11
  Top 0.203: R22.1 39.18,35.69 R10.2 40.39,35.68 Q1.1
N$12
  Top 0.254: R4.1 51.46,50.02 51.82,49.66 U1.7
N$13
  Top 0.203: U3.8 14.22,42.04 C1.1 12.7,44.7 X1.1
N$14
  Top 0.406: U6.5 26.04,46.64 C25.2 R8.2 26.04,48.26
N$15  (via drill 0.3 pad 0.64)
  Top 0.406: Q1.3 v42.42,37.47 44.07,35.81 R9.1 | v38.23,45.09 38.9,45.09 U5.G
  Bottom 0.203: v38.23,45.09 38.23,41.66 v42.42,37.47
N$16
  Top 0.406: STATUS.- R15.1
N$17
  Top 0.406: R23.2 27.56,48.51 C23.1 29.21,46.64 U6.4
N$18
  pour Top (isolate 0.254, no thermals): 8.26,58.55 4.8,55.1 arc135 5.16,54.23 7.43,54.23 arc-90 8,53.66 8,53.6 arc90 9.02,52.58 14.48,52.58 14.48,58.55
  pour Bottom (isolate 0.254, no thermals): 8.26,58.55 4.8,55.1 arc135 5.16,54.23 7.43,54.23 arc-90 8,53.66 8,53.57 arc90 8.99,52.58 14.48,52.58 14.48,58.55
N$19
  pour Top (isolate 0.254, no thermals): 7.32,49.15 2.65,49.15 arc-90 1.91,49.89 1.91,51.84 arc-90 2.65,52.58 7.37,52.58 arc-90 8,51.94 8,49.83 arc-90
  pour Bottom (isolate 0.254, no thermals): 7.32,49.15 2.65,49.15 arc-90 1.91,49.89 1.91,51.84 arc-90 2.65,52.58 7.37,52.58 arc-90 8,51.94 8,49.83 arc-90
N$20
  Top 0.406: R28.1 18.67,52.84 Q2.1 16.98,52.84 15.49,51.35 Q3.3
N$21
  Top 0.406: Q3.1 13.46,50.8 R29.2 R30.1
N$38
  Top 1.676: L1.1 48,42.67 D8.-
  pour Top (isolate 0.254, no thermals): 51.69,40.89 50.04,40.89 arc-90 49.4,41.53 49.4,47.24 arc90 48.77,47.88 47.75,47.88 arc-90 47.37,48.26 47.37,48.58 arc-90 47.75,48.96 51.69,48.96 arc-90 52.32,48.32 52.32,41.53 arc-90
N$47
  Top 0.305: U1.5 55.11,47.12 R6.1 55.3,48.46 R5.1
NETLIGHT  (via drill 0.3 pad 0.64)
  Top 0.203: U3.11 16.3,38.94 17.14,38.1 v18.41,38.1 | v52.2,7.75 52.2,8.64 52.07,8.76 51.8,8.76 U2.52
  Top 0.254: U3.11 10.92,38.94 R21.2
  Bottom 0.203: v52.2,7.75 28.19,7.75 25.65,10.29 25.65,32.13 19.68,38.1 v18.41,38.1
PANEL  (via drill 0.3, 0.3 pad 0.64)
  Top 0.406: U6.3 29.84,44.04 v29.84,42.55
  Top 0.508: v13.97,31.24 19.68,31.24 20.19,30.73 23.96,30.73 U4.3 25.01,30.72 | C6.2 25.78,29.46 25.27,29.97 25.27,30.48 | 25.27,30.48 25.27,30.99 | 25.01,30.72 25.27,30.99 | 25.01,30.72 25.03,30.72 25.27,30.48 | v45.34,33.53 45.34,35.9 R9.2 44.58,37.68 44.58,43.43 42.99,45.02 U5.S | 25.27,30.99 25.27,32.89 25.91,33.53 27.3,33.53 | 27.3,33.53 27.3,34.4 R26.2 | 27.3,33.53 v28.7,33.53
  Bottom 0.406: v13.97,31.24 13.97,26.8 14.1,26.67 14.1,26.6 PANEL.TP | v29.84,42.55 31.64,42.55 33.55,44.45 36.2,44.45 40.01,48.26 40.01,48.94 PANEL+.P$1
  Bottom 0.508: v28.7,33.53 v45.34,33.53
  pour Top (isolate 0.305, rank 2, no thermals): 43.31,43.94 arc90 43.81,44.45 43.81,52.7 arc90 43.18,53.34 38.76,53.34 arc90 37.85,52.42 37.85,47.85 arc90 38.84,46.86 39.24,46.86 arc-90 39.88,46.23 39.88,43.94
PANEL_CURRENT
  Top 0.203: U3.23 19.76,32.01 20.14,31.62 23.92,31.62 U4.2
PANEL_EN  (via drill 0.3 pad 0.64)
  Top 0.203: R22.2 v36.7,37.21 | 13.5,40.51 U3.9 16.35,40.54 16.76,40.13 20.07,40.13 21.72,41.78 v22.48,41.78
  Bottom 0.203: v36.7,37.21 25.15,37.21 22.35,40.01 22.35,41.78 v22.48,41.78
PANEL_SWITCH
  Top 0.254: U5.D 40.86,40.6 40.26,40.01
  Top 0.406: R7.1 41.68,33.63 41.53,33.78 41.53,36.2 41.27,36.45 40.77,36.45 40.39,36.83 40.39,39.88 40.26,40.01
  pour Top (isolate 0.254, no thermals): 32.51,39.24 32.51,42.55 arc-90 33.15,43.18 43.18,43.18 arc-90 43.81,42.55 43.81,39.24 arc-90 43.18,38.61 33.15,38.61 arc-90
PANEL_VOLTAGE
  Top 0.203: R27.2 25.8,37.47 C14.2
  Top 0.254: U3.24 20.89,33.78 23.24,33.78 23.87,34.41 R26.1 R27.2
PWRKEY  (via drill 0.3 pad 0.64)
  Top 0.203: v45.4,30.29 47.43,30.29 47.82,29.91 47.82,28.78 U2.1
  Top 0.254: Q7.3 v20.45,47.12
  Bottom 0.254: v45.4,30.29 46.19,31.07 46.19,33.94 45.71,34.42 27.3,34.42 21.84,39.87 21.84,45.72 v20.45,47.12
RSENSE+
  Top 0.254: C10.1 43.75,31.94 R7.2 41.68,31.9 40.77,30.99 36.2,30.99 36.2,30.1 29.72,30.1 28.83,30.99 27.18,30.99 26.92,30.73 | 26.92,30.73 26.96,30.73 | U4.4 26.91,30.72 26.92,30.73
RSENSE-
  Top 0.254: C12.1 39.56,31.94 R11.2 37.52,31.93 37.08,31.5 35.69,31.5 35.69,30.61 30.1,30.61 29.21,31.5 26.8,31.5 26.54,31.75 26.54,32.6 U4.5 26.94,32.62
RST  (via drill 0.3, 0.3 pad 0.64)
  Top 0.203: U3.29 21,38.14 18.67,35.81 v18.41,35.81
  Top 0.254: v12.19,36.2 11.81,36.2 | 11.81,36.2 C8.1 | 11.81,36.2 11.2,35.58 R3.1
  Bottom 0.203: v12.19,36.2 15.37,36.2 | 15.37,36.2 15.49,36.2 | 15.49,36.07 15.49,35.56 16.63,34.43 16.63,14.63 RST.TP | 15.49,36.07 15.49,36.2 | 15.49,36.2 15.62,36.2 | 15.62,36.2 18.03,36.2 v18.41,35.81 | 15.49,36.07 15.37,36.2 | 15.49,36.07 15.62,36.2
RX  (via drill 0.3 pad 0.64)
  Top 0.203: U3.30 21.04,38.94 18.92,36.83 v18.41,36.83
  Top 0.254: TTL.3 18.78,21.78 v20.34,23.34
  Bottom 0.203: v20.34,23.34 21.14,24.14 21.14,35.38 19.68,36.83 v18.41,36.83 | 19.27,22.27 RX.TP
  Bottom 0.254: v20.34,23.34 19.27,22.27
SCK  (via drill 0.3)
  Top 0.254: v11.05,33.91 14.96,33.91 U3.17
  Bottom 0.254: SCK.TP 11.26,24.26 11.26,33.92 11.05,33.92 v11.05,33.91
SIM_CLK
  Top 0.203: U2.32 26.49,10.74 R18.2
SIM_CLK_DIRECT  (via drill 0.3 pad 0.64)
  Top 0.203: SIMHOLDER.3 12.46,4.94 v12.32,5.08 16.93,9.69 R18.1
  Bottom 0.203: v12.32,5.08 11.56,5.08 9.14,7.49 VCC1.TP
SIM_DATA
  Top 0.203: U2.31 26.03,11.74 R19.1
SIM_DATA_DIRECT  (via drill 0.3 pad 0.64)
  Top 0.203: 23.93,11.18 23.11,11.18 22.86,11.43 22.86,23.09 19.27,26.67 12.83,26.67 12.57,26.92 12.57,28.18 SIMHOLDER.4
  Top 0.254: v9.02,28.19 12.52,28.19 SIMHOLDER.4 | 23.93,11.18 R19.2
  Bottom 0.254: GND11.TP 9,28.18 v9.02,28.19
SIM_RST
  Top 0.203: U2.33 26.99,9.74 R17.2
SIM_RST_DIRECT  (via drill 0.3 pad 0.64)
  Top 0.203: SIMHOLDER.2 14.91,5.03 v14.86,5.08 17.98,8.2 R17.1
  Bottom 0.203: SCK1.TP 14,5.94 v14.86,5.08
SIM_VDD  (via drill 0.3 pad 0.64)
  Top 0.406: SIMHOLDER.1 17.51,5.06 v17.53,5.08 19.12,6.67 C20.1 23.88,6.64 v23.88,5.84 | U2.30 24.34,12.74 v24.26,12.83
  Bottom 0.203: RST1.TP 19.18,7.5
  Bottom 0.406: v17.53,5.08 17.53,6.03 RST1.TP | v24.26,12.83 24.26,6.22 v23.88,5.84
STATUS  (via drill 0.3 pad 0.64)
  Top 0.203: U3.10 16.52,39.74 v17.53,38.73 | U2.66 52.97,22.74 53.21,22.99 53.21,26.56 48.84,30.92 v42.04,30.92
  Top 0.254: U3.10 11.56,39.74 11.18,40.13 R20.2
  Bottom 0.203: v17.53,38.73 19.56,38.73 26.04,32.26 26.04,29.34 27.3,28.07 39.24,28.07 39.24,28.13 v42.04,30.92
TX  (via drill 0.3 pad 0.64)
  Top 0.203: U3.31 21.07,39.74 18.8,37.47 v17.53,37.47
  Top 0.254: TTL.2 19.62,19.24 v20.43,18.43
  Bottom 0.203: v17.53,37.47 19.68,37.47 21.59,35.56 21.59,34.79 21.6,34.78 21.6,19.6 v20.43,18.43
  Bottom 0.254: v20.43,18.43 TX.TP
VCC  (via drill 0.3, 0.3 pad 0.64, 0.38 pad 0.81)
  Top 0.254: U3.6 16.56,43.61 C17.2 | 6.71,48.24 v6.73,48.26 | 9.27,30.23 9.4,30.1
  Top 0.305: R6.2 56.82,42.91 L1.2 | C17.2 v17.4,43.69 | 18.16,43.69 C18.2 18.16,43.56 U3.4
  Top 0.406: U3.20 17.4,33.45 17.4,32.13 15.76,32.13 | 15.76,32.13 U3.18 15.75,33.45 15.75,32.13 13.21,32.13 C7.2 13.19,32.77 | R3.2 9.53,35.46 9.53,32.89 9.27,32.89 C2.+ | POWER.+ NETLIGHT.+ STATUS.+ 6.71,48.24 | 15.76,32.13 12.95,32.13 12.95,30.1
  Top 0.61: 4.7,30.1 4.83,30.23 | 9.27,30.23 9.27,32.89
  Top 1.016: v17.4,43.69 18.16,43.69 | TTL.4 4.7,26.16 4.7,30.1 9.4,30.1 12.95,30.1 19.18,30.1 21.46,27.81 26.67,27.81 27.94,29.08 v27.94,29.84 | C9.2 46.9,33.63 v45.34,32.07
  Bottom 0.406: v6.73,48.26 12.32,48.26 17.4,43.18
  Bottom 0.61: VCC.TP 6.37,17 5.21,18.16 5.21,21.97 TTL.4
  Bottom 1.016: 27.94,32.51 v27.94,29.84 | 27.94,32.51 17.4,43.05 17.4,43.18 v17.4,43.69 | 27.94,32.51 44.9,32.51 v45.34,32.07
  Bottom 2.032: v55.75,13.08 50.67,13.08 49.41,14.34 49.41,21.47 53.85,25.91 v53.85,35.18
  other vias: 54.86,13.59 54.86,12.57 53.21,34.54 54.48,34.54
  pour Top (isolate 0.254, no thermals): 50.94,14.03 57.34,14.03 arc-90 57.53,13.84 57.53,11.61 arc-90 57.35,11.43 50.98,11.43 arc-90 50.8,11.61 50.8,13.89 arc-90
  pour Top (isolate 0.254, no thermals): 52.7,35.56 52.7,33.66 arc90 53.09,33.27 57.66,33.27 arc90 58.04,33.66 58.04,43.94 arc90 57.66,44.32 55.5,44.32 arc90 55.12,43.94 55.12,36.32 arc-90 54.74,35.94 53.09,35.94 arc90
VDD
  Top 0.254: R4.2 49.93,50.06 49.53,49.66 U1.2
  Top 0.61: U1.2 46.25,49.66 C24.2
  Top 1.016: R4.2 47.3,52.76 arc45 C11.2 | C24.2 46.1,51.18 47.12,52.2 47.12,54.48 47.88,55.24 47.88,55.82 D2.C
VRTC
  Top 0.508: U2.26 24.61,16.74 24.51,16.64 C15.+

### Text on the board
tPlace: PANEL- | SIMHOLDER | v2.6, January 2014
bPlace: SIM_IO | SIM_CLK | SIM_RST | SIM_VDD
tNames: NET